# Altium schematic sheet MergenElektronik_DesignBlocks_USB_Type-C-Device.SchDoc: USB-C 2.0 Device Mode Usage Method
size A4; ApprovedBy: Ekrem Turan Fırat; CheckedBy: Ekrem Turan Fırat; Author: Ekrem Turan Fırat; CompanyName: Mergen Elektronik; DrawnBy: Ekrem T. Fırat; Engineer: Ekrem Turan Fırat; Organization: Mergen Elektronik; Address1: 06820; Address2: Etimesgut  /; Address3: Ankara; Address4: Türkiye; DocumentNumber: 25-03-0001; Revision: v1.0.0; SheetNumber: 1; SheetTotal: 1
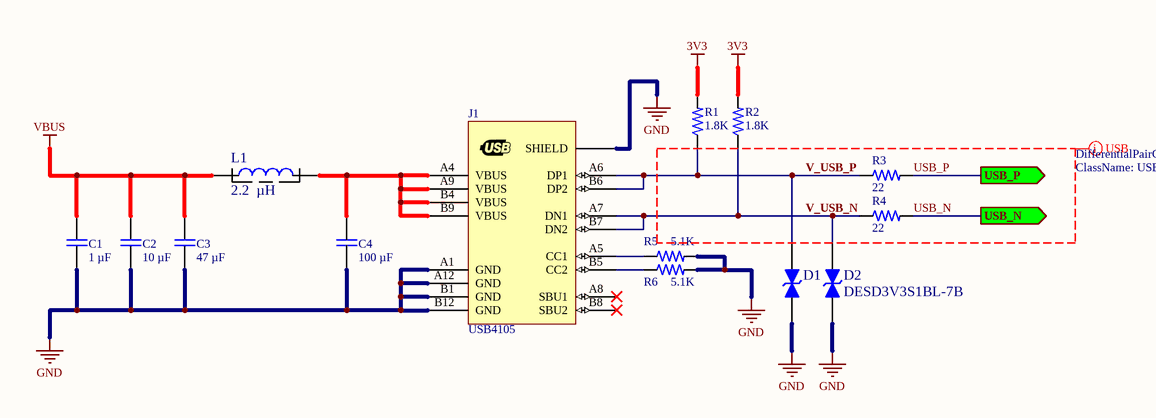
[diagram p0: MergenElektronik_DesignBlocks_USB_Type-C-Device.SchDoc]

## Parts
C1  1 µF  [MergenElektronik_Capacitors_Ceramics_SMDs_1206_S_NS]
C2  10 µF  [MergenElektronik_Capacitors_Ceramics_SMDs_0603_S_NS]
C3  47 µF  [MergenElektronik_Capacitors_Ceramics_SMDs_1206_L]
C4  100 µF  [MergenElektronik_Capacitors_Ceramics_SMDs_1210_S_NS]
D1  DESD3V3S1BL-7B  [MergenElektronik_Diodes_TVSDiodes_0402_L]  (value not drawn)
D2  DESD3V3S1BL-7B  [MergenElektronik_Diodes_TVSDiodes_0402_L]
J1  USB4105  [MergenElektronik_Connectors_USB_USB4105]
L1  2.2  µH  [MergenElektronik_Inductors_PowerInductors_SMDs_1008_S_NS]
R1  1.8K  [MergenElektronik_Resistors_ChipResistors_0603_S_NS]
R2  1.8K  [MergenElektronik_Resistors_ChipResistors_0603_S_NS]
R3  22  [MergenElektronik_Resistors_ChipResistors_0603_S]
R4  22  [MergenElektronik_Resistors_ChipResistors_0603_S]
R5  5.1K  [MergenElektronik_Resistors_ChipResistors_0603_S_NS]
R6  5.1K  [MergenElektronik_Resistors_ChipResistors_0603_S_NS]

## Ports
USB_N (out, see Microcontroller[3C]), USB_P (out, see Microcontroller[3C])

## Nets
3V3: R1.2 R2.2
GND: C1.2 C2.2 C3.2 C4.2 D1.1(ANOT) D2.1(ANOT) J1.A1(GND) J1.A12(GND) J1.B1(GND) J1.B12(GND) J1.SHIELD R5.2 R6.2
VBUS: C1.1 C2.1 C3.1 L1.1
USB_N: R4.2 ; port USB_N
USB_P: R3.2 ; port USB_P
V_USB_N: D2.2(KATOT) J1.A7(DN1) J1.B7(DN2) R2.1 R4.1
V_USB_P: D1.2(KATOT) J1.A6(DP1) J1.B6(DP2) R1.1 R3.1
NetC4_1: C4.1 J1.A4(VBUS) J1.A9(VBUS) J1.B4(VBUS) J1.B9(VBUS) L1.2
NetJ1_A5: J1.A5(CC1) R5.1
NetJ1_B5: J1.B5(CC2) R6.1

Not connected (* = marked no-connect by the designer): J1 A8(SBU1)* B8(SBU2)*

## Layout directives
differential pair; differential pair class USB_Lines; net class USB: USB_N, USB_P, V_USB_N, V_USB_P

## Notes on the sheet
- Title:
- Size:
- Date:
- A4
- Number:
- Time:
- Revision:
- Sheet
- of
- Project
- Drawn By :

## Library data of the parts
C1 = MergenElektronik_Capacitors_Ceramic_SMDs_1µF_100V: Mergen Elektronik - Capacitors - Ceramics - SMDs - 1206 - 1 µF - 100V; Manufacturer: Samsung Electro-Mechanics; Manufacturer Number: CL31B105KCHNNNE; Model: Ceramic Capacitors; Tolerance: ±10%; Value: 1 µF; Temperature: -55°C up to +125°C; Digi-Key Number: 1276-1838-1-ND; Package: 1206(3216 Metric); Mouser Number: 187-CL31B105KCHNNNE; Mounting Type: Surface Mount; Özdisan Number: CL31B105KCHNNNE; Supplier 1: Digikey; Supplier 2: Mouser; Supplier Part Number 1: 1276-1838-1-ND; Supplier Part Number 2: 187-CL31B105KCHNNNE; Voltage Rating: 100V
C2 = MergenElektronik_Capacitors_Ceramic_SMDs_10µF_25V: Mergen Elektronik - Capacitors - Ceramics - SMDs - 0603 - 10 µF - 25V; Manufacturer: Murata Electronics; Manufacturer Number: GRT188R61E106ME13D; Model: Ceramic Capacitors; Tolerance: ±20%; Value: 10 µF; Temperature: -55°C up to +85°C; Digi-Key Number: 490-12323-1-ND; Package: 0603(1608); Farnell Number: 3581819; Mouser Number: 81-GRT188R61E106ME3D; Mounting Type: Surface Mount; Supplier 1: Digi-Key; Supplier 2: Mouser; Supplier Part Number 1: 490-12323-1-ND; Supplier Part Number 2: 81-GRT188R61E106ME3D; Voltage Rating: 25V
C3 = MergenElektronik_Capacitors_Ceramic_SMDs_47µF_25V: Mergen Elektronik - Capacitors - Ceramics - SMDs - 1206 - 47 µF - 25V; Manufacturer: TDK Corporation; Manufacturer Number: C3216X5R1E476M160AC; Model: Ceramic Capacitors; Tolerance: ±20%; Value: 47 µF; Temperature: -55°C up to +85°C; Digi-Key Number: 445-8047-2-ND; Package: 1206(3216); Mouser Number: 810-C3216X5R1E476M; Mounting Type: Surface Mount; Supplier 1: Digi-Key; Supplier 2: Mouser; Supplier Part Number 1: 445-8047-2-ND; Supplier Part Number 2: 810-C3216X5R1E476M; Özdisan Number: C3216X5R1E476M160AC; Farnell Number: 2525172; Voltage Rating: 25V
C4 = MergenElektronik_Capacitors_Ceramic_SMDs_100µF_10V: Mergen Elektronik - Capacitors - Ceramics - SMDs - 1210 - 100 µF - 10V; Manufacturer: Samsung Electro-Mechanics; Manufacturer Number: CL32A107MPVNNNE; Model: Ceramic Capacitors; Tolerance: ±20%; Özdisan Number: CL10B104KO8NNNC; Value: 100 µF; Temperature: -55°C up to +85°C; Digi-Key Number: 1276-3364-1-ND; Package: 1210(3225 Metric); Mouser Number: 187-CL32A107MPVNNNE; Mounting Type: Surface Mount; Farnell Number: 1838744; Supplier 1: Mouser; Supplier 2: Digi-Key; Supplier Part Number 1: 187-CL10B104KO8NNNC; Supplier Part Number 2: 1276-1005-6-ND; Voltage Rating: 10V
D1 D2 = MergenElektronik_Diodes_TVSDiodes_DESD3V3S1BL-7B: Mergen Elektronik - Diodes - TVS Diodes - DESD3V3S1BL-7B; Manufacturer: Diodes Incorporated; Breakdown Voltage: 3.8V; Current - Peak Pulse: 5A(8/20µs); Voltage Reverse Standoff: 3.3V(Max); Capacitance @ Frequency: 10pF @ 1MHz; Voltae Clamping: 7V; Digi-Key Number: DESD3V3S1BL-7BDITR-ND; Manufacturer Number: DESD3V3S1BL-7B; Model: TVS Diodes; Mounting Type: Surface Mount; Package: 0402 (1006 Metric); Temperature: -65°C up to +150°C; Value: DESD3V3S1BL-7B; Mouser Number: 621-DESD3V3S1BL-7B; Farnell Number: 3127287; Supplier 1: Digikey; Supplier 2: Mouser; Supplier Part Number 2: DESD3V3S1BL-7BDITR-ND; Supplier Part Number 1: 621-DESD3V3S1BL-7B
J1 = MergenElektronik_Connectors_USB_USB4105: Mergen Elektronik - Connectors - USB Connectors - USB4105; Manufacturer: GCT; Manufacturer Number: USB4105-GF-A; Model: Type - C / USB 2.0; Current Rating: 0.25A, 1.25A, 5A, 6.25A; Voltage Rating: 20VDC; Value: USB4105; Mounting Type: THT - SMD R/A; Temperature: -40°C up to 85°C; Digi-Key Number: 2073-USB4105-GF-ACT-ND; Mouser Number: 640-USB4105-GF-A; Farnell Number: 3588205; Özdisan Number: USB4105-GF-A; Supplier 1: Digi-Key; Supplier Part Number 1: 2073-USB4105-GF-ADKR-ND; Supplier 2: Mouser; Supplier Part Number 2: 640-USB4105-GF-A; Package: USB4105
L1 = MergenElektronik_Inductors_PowerInductors_SMDs_1008_2.2µH-2A: Mergen Elektronik - Inductors - Power Inductors - SMDs - 1008 - 2.2 µh - 2A; Manufacturer: Samsung Electro-Mechanics; Manufacturer Number: CIGT252008LM2R2MNE; Digi-Key Number: 1276-6925-1-ND; Model: Power Inductor; Mounting Type: Surface Mount; Package: 1008 (2520 Metric); Temperature: -40°C up to  125°C; Value: 2.2  µH; Current Rating: 2A; Mouser Number: 187-CIGT252008LM2R2M; Supplier 1: Digi-Key; Supplier 2: Mouser; Supplier Part Number 1: 1276-6925-6-ND; Supplier Part Number 2: 187-CIGT252008LM2R2M
R1 R2 = MergenElektronik_Resistors_ChipResistors_0603_1.8K: Mergen Elektronik - Resistors - Chip Resistors - 0603 - 1.8K; Manufacturer: Stackpole Electronics Inc; Manufacturer Number: RMCF0603JT1K80; Value: Chip Resistor - 0603 - 1.8K; Power: 1/10W; Tolerance: ±5%; Package: 0603(1608); Temperature: -55°C up to +155°C - X8R; Model: Chip Resistor; Digi-Key Number: RMCF0603JT1K80TR-ND; Mounting Type: Surface Mount; Mouser Number: 708-RMCF0603JT1K80; Supplier 1: Digikey; Supplier 2: Mouser; Supplier Part Number 1: RMCF0603JT1K80TR-ND; Supplier Part Number 2: 708-RMCF0603JT1K80
R3 R4 = MergenElektronik_Resistors_ChipResistors_0603_22: Mergen Elektronik - Resistors - Chip Resistors - 0603 - 22; Manufacturer: TE Connectivity Passive Product; Manufacturer Number: CRGCQ0603J22R; Value: Chip Resistor - 0603 - 22; Power: 1/10W; Tolerance: ±5%; Özdisan Number: RMCF0603ZT0R00; Package: 0603(1608); Temperature: -55°C up to +155°C - X8R; Model: Chip Resistor; Digi-Key Number: A130081CT-ND; Mounting Type: Surface Mount; Mouser Number: 279-CRGCQ0603J22R; Farnell Number: 2861854; Supplier 1: Digi-Key; Supplier 2: Mouser; Supplier Part Number 1: A130081CT-ND; Supplier Part Number 2: 279-CRGCQ0603J22R
R5 R6 = MergenElektronik_Resistors_ChipResistors_0603_5.1K: Mergen Elektronik - Resistors - Chip Resistors - 0603 - 5.1K; Manufacturer: Stackpole Electronics Inc; Manufacturer Number: RMCF0603JT5K10; Value: Chip Resistor - 0603 - 5.1K; Power: 1/10W; Tolerance: ±5%; Package: 0603(1608); Temperature: -55°C up to +155°C - X8R; Model: Chip Resistor; Digi-Key Number: RMCF0603JT5K10CT-ND; Mounting Type: Surface Mount; Mouser Number: 708-RMCF0603JT5K10; Supplier 1: Digi-Key; Supplier Part Number 1: RMCF0603JT5K10DKR-ND